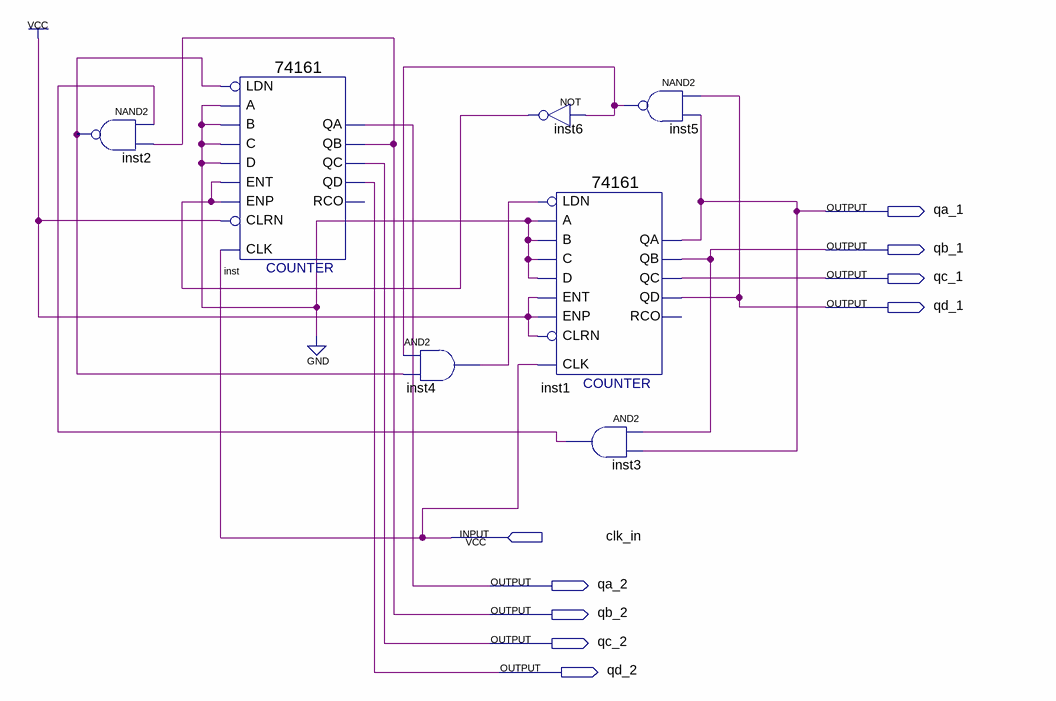
[diagram p0: schematic sheet]
// Quartus schematic selector.bdf as structural Verilog: 7 symbols, 9 pins
module selector (
  input  clk_in,
  output qa_1,
  output qb_1,
  output qc_1,
  output qd_1,
  output qa_2,
  output qb_2,
  output qc_2,
  output qd_2
);

  wire inst2_out, inst3_out, inst4_out, inst5_out, inst6_out;

  nand inst2 (inst2_out, inst3_out, qb_2);
  \74161  inst (
    .CLRN(1'b1), .CLK(clk_in), .ENP(inst6_out), .LDN(inst2_out), .A(1'b0), .D(1'b0), .ENT(inst6_out),
    .B(1'b0), .C(1'b0), .QD(qd_2), .QC(qc_2), .QB(qb_2), .QA(qa_2));  // open: RCO
  and inst4 (inst4_out, inst5_out, inst2_out);
  not inst6 (inst6_out, inst5_out);
  \74161  inst1 (
    .CLRN(1'b1), .CLK(clk_in), .ENP(1'b1), .LDN(inst4_out), .A(1'b0), .D(1'b0), .ENT(1'b1), .B(1'b0),
    .C(1'b0), .QD(qd_1), .QC(qc_1), .QB(qb_1), .QA(qa_1));  // open: RCO
  and inst3 (inst3_out, qb_1, qa_1);
  nand inst5 (inst5_out, qd_1, qa_1);
endmodule
